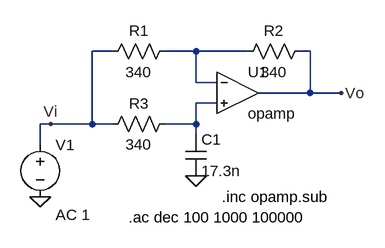
[diagram p0: schematic ej6b.asc]
ej6b.asc, the LTspice schematic file:
Version 4
SHEET 1 880 680
WIRE 0 96 -32 96
WIRE 128 96 80 96
WIRE 208 96 128 96
WIRE 304 96 288 96
WIRE 128 144 128 96
WIRE 160 144 128 144
WIRE 304 160 304 96
WIRE 304 160 224 160
WIRE 352 160 304 160
WIRE 160 176 128 176
WIRE -96 208 -112 208
WIRE -32 208 -32 96
WIRE -32 208 -96 208
WIRE 0 208 -32 208
WIRE 128 208 128 176
WIRE 128 208 80 208
WIRE 128 224 128 208
WIRE -112 240 -112 208
FLAG 128 288 0
FLAG 352 160 Vo
FLAG -96 208 Vi
FLAG -112 320 0
SYMBOL OpAmps\\opamp 192 96 R0
SYMATTR InstName U1
SYMATTR SpiceLine2 GBW=10000Meg
SYMBOL res 96 80 R90
WINDOW 0 0 56 VBottom 2
WINDOW 3 32 56 VTop 2
SYMATTR InstName R1
SYMATTR Value 340
SYMBOL res 304 80 R90
WINDOW 0 0 56 VBottom 2
WINDOW 3 32 56 VTop 2
SYMATTR InstName R2
SYMATTR Value 340
SYMBOL res 96 192 R90
WINDOW 0 0 56 VBottom 2
WINDOW 3 32 56 VTop 2
SYMATTR InstName R3
SYMATTR Value 340
SYMBOL cap 112 224 R0
SYMATTR InstName C1
SYMATTR Value 17.3n
SYMBOL voltage -112 224 R0
WINDOW 123 24 124 Left 2
WINDOW 39 0 0 Left 0
SYMATTR Value2 AC 1
SYMATTR InstName V1
SYMATTR Value ""
TEXT 24 352 Left 2 !.ac dec 100 1000 100000
TEXT 168 320 Left 2 !.inc opamp.sub

The netlist it stands for:
* ej6b.asc
XU1 N001 N002 Vo opamp Aol=100K GBW=10000Meg  ; pins invin noninvin out
R1 N001 Vi 340
R2 Vo N001 340
R3 N002 Vi 340
C1 N002 0 17.3n
V1 Vi 0 AC 1
.ac dec 100 1000 100000
.inc opamp.sub
.backanno
.end